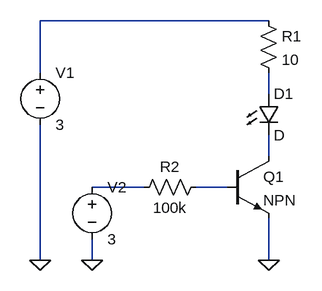
[diagram p0: schematic Draft1.asc]
Draft1.asc, the LTspice schematic file:
Version 4
SHEET 1 880 680
WIRE 160 144 -192 144
WIRE -192 224 -192 144
WIRE 160 256 160 224
WIRE 160 352 160 320
WIRE -32 400 -112 400
WIRE 96 400 48 400
WIRE -192 512 -192 304
WIRE -112 512 -112 480
WIRE 160 512 160 448
FLAG 160 512 0
FLAG -112 512 0
FLAG -192 512 0
SYMBOL res 144 128 R0
SYMATTR InstName R1
SYMATTR Value 10
SYMBOL LED 144 256 R0
SYMATTR InstName D1
SYMBOL voltage -192 208 R0
SYMATTR InstName V1
SYMATTR Value 3
SYMATTR SpiceLine Rser=20
SYMBOL voltage -112 384 R0
SYMATTR InstName V2
SYMATTR Value 3
SYMATTR SpiceLine Rser=1
SYMBOL npn 96 352 R0
SYMATTR InstName Q1
SYMBOL res 64 384 R90
WINDOW 0 0 56 VBottom 2
WINDOW 3 32 56 VTop 2
SYMATTR InstName R2
SYMATTR Value 100k

The netlist it stands for:
* Draft1.asc
R1 N001 N002 10
D1 N002 N003 D
V1 N001 0 3 Rser=20
V2 N004 0 3 Rser=1
Q1 N003 N005 0 0 NPN
R2 N005 N004 100k
.model D D
.lib standard.dio
.model NPN NPN
.model PNP PNP
.lib standard.bjt
.backanno
.end